# EAGLE design VCA (EAGLE 8.2.0)
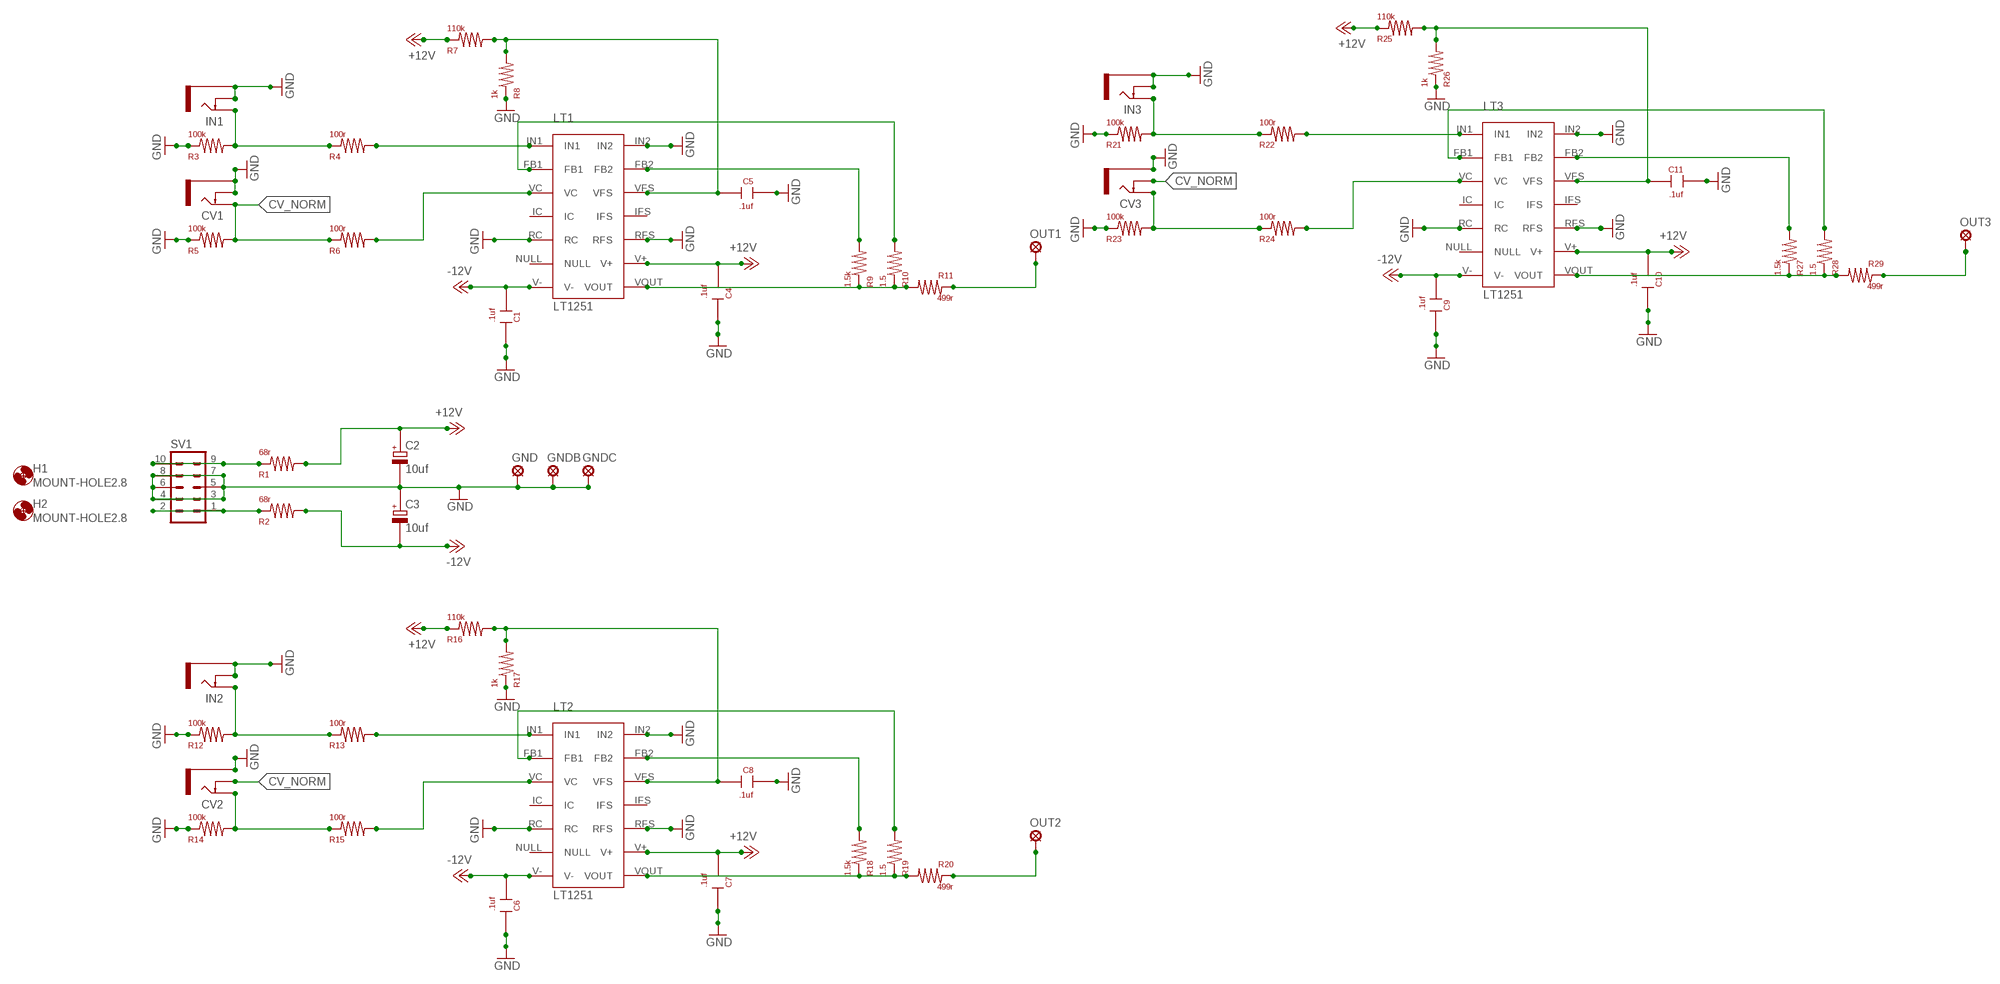
[diagram p0: schematic, sheet 1]

## Parts
C1  .1uf  CAPACITOR_FILM  [CAPACITOR_FILM]
C2  10uf  CAPACITOR_ELECTRO  [CAPACITOR_ELECTRO]
C3  10uf  CAPACITOR_ELECTRO  [CAPACITOR_ELECTRO]
C4  .1uf  CAPACITOR_FILM  [CAPACITOR_FILM]
C5  .1uf  CAPACITOR_FILM  [CAPACITOR_FILM]
C6  .1uf  CAPACITOR_FILM  [CAPACITOR_FILM]
C7  .1uf  CAPACITOR_FILM  [CAPACITOR_FILM]
C8  .1uf  CAPACITOR_FILM  [CAPACITOR_FILM]
C9  .1uf  CAPACITOR_FILM  [CAPACITOR_FILM]
C10  .1uf  CAPACITOR_FILM  [CAPACITOR_FILM]
C11  .1uf  CAPACITOR_FILM  [CAPACITOR_FILM]
CV1  PJ302M  [PJ302M]
CV2  PJ302M  [PJ302M]
CV3  PJ302M  [PJ302M]
GND  LSP10  [LSP10]
GNDB  LSP10  [LSP10]
GNDC  LSP10  [LSP10]
H1  MOUNT-HOLE2.8  [2,8]
H2  MOUNT-HOLE2.8  [2,8]
IN1  PJ302M  [PJ302M]
IN2  PJ302M  [PJ302M]
IN3  PJ302M  [PJ302M]
LT1  LT1251  [TL1251]
LT2  LT1251  [TL1251]
LT3  LT1251  [TL1251]
OUT1  LSP10  [LSP10]
OUT2  LSP10  [LSP10]
OUT3  LSP10  [LSP10]
R1  68r  RESISTOR  [RESISTOR]
R2  68r  RESISTOR  [RESISTOR]
R3  100k  RESISTOR  [RESISTOR]
R4  100r  RESISTOR  [RESISTOR]
R5  100k  RESISTOR  [RESISTOR]
R6  100r  RESISTOR  [RESISTOR]
R7  110k  RESISTOR  [RESISTOR]
R8  1k  RESISTOR  [RESISTOR]
R9  1.5k  RESISTOR  [RESISTOR]
R10  1.5  RESISTOR  [RESISTOR]
R11  499r  RESISTOR  [RESISTOR]
R12  100k  RESISTOR  [RESISTOR]
R13  100r  RESISTOR  [RESISTOR]
R14  100k  RESISTOR  [RESISTOR]
R15  100r  RESISTOR  [RESISTOR]
R16  110k  RESISTOR  [RESISTOR]
R17  1k  RESISTOR  [RESISTOR]
R18  1.5k  RESISTOR  [RESISTOR]
R19  1.5  RESISTOR  [RESISTOR]
R20  499r  RESISTOR  [RESISTOR]
R21  100k  RESISTOR  [RESISTOR]
R22  100r  RESISTOR  [RESISTOR]
R23  100k  RESISTOR  [RESISTOR]
R24  100r  RESISTOR  [RESISTOR]
R25  110k  RESISTOR  [RESISTOR]
R26  1k  RESISTOR  [RESISTOR]
R27  1.5k  RESISTOR  [RESISTOR]
R28  1.5  RESISTOR  [RESISTOR]
R29  499r  RESISTOR  [RESISTOR]
SV1  EURORACK10  [EURORACK10]

## Nets
+12V: C2.+ C4.P$2 C7.P$2 C10.P$2 LT1.V+ LT2.V+ LT3.V+ R1.P$2 R7.P$1 R16.P$1 R25.P$1
-12V: C1.P$2 C3.- C6.P$2 C9.P$2 LT1.V- LT2.V- LT3.V- R2.P$2
CV_NORM: CV1.TIP CV2.SW(SWITCH) CV3.SW(SWITCH) R5.P$2 R6.P$1
GND: C1.P$1 C2.- C3.+ C4.P$1 C5.P$1 C6.P$1 C7.P$1 C8.P$1 C9.P$1 C10.P$1 C11.P$1 CV1.GND(SLEEVE) CV1.SW(SWITCH) CV2.GND(SLEEVE) CV3.GND(SLEEVE) GND.MP GNDB.MP GNDC.MP IN1.GND(SLEEVE) IN1.SW(SWITCH) IN2.GND(SLEEVE) IN2.SW(SWITCH) IN3.GND(SLEEVE) IN3.SW(SWITCH) LT1.IN2 LT1.RC LT1.RFS LT2.IN2 LT2.RC LT2.RFS LT3.IN2 LT3.RC LT3.RFS R3.P$1 R5.P$1 R8.P$1 R12.P$1 R14.P$1 R17.P$1 R21.P$1 R23.P$1 R26.P$1 SV1.3 SV1.4 SV1.5 SV1.6 SV1.7 SV1.8
N$1: LT1.IN1 R4.P$2
N$2: R1.P$1 SV1.9 SV1.10
N$3: IN2.TIP R12.P$2 R13.P$1
N$4: LT1.VC R6.P$2
N$5: CV2.TIP R14.P$2 R15.P$1
N$6: LT2.IN1 R13.P$2
N$7: C5.P$2 LT1.VFS R7.P$2 R8.P$2
N$8: R2.P$1 SV1.1 SV1.2
N$9: IN1.TIP R3.P$2 R4.P$1
N$11: LT1.VOUT R9.P$1 R10.P$1 R11.P$2
N$12: LT1.FB2 R9.P$2
N$13: LT1.FB1 R10.P$2
N$14: OUT1.MP R11.P$1
N$15: LT2.VC R15.P$2
N$16: C8.P$2 LT2.VFS R16.P$2 R17.P$2
N$17: LT2.VOUT R18.P$1 R19.P$1 R20.P$2
N$18: LT2.FB2 R18.P$2
N$19: LT2.FB1 R19.P$2
N$20: OUT2.MP R20.P$1
N$21: IN3.TIP R21.P$2 R22.P$1
N$23: LT3.IN1 R22.P$2
N$24: LT3.VC R24.P$2
N$25: C11.P$2 LT3.VFS R25.P$2 R26.P$2
N$26: LT3.VOUT R27.P$1 R28.P$1 R29.P$2
N$27: LT3.FB2 R27.P$2
N$28: LT3.FB1 R28.P$2
N$29: OUT3.MP R29.P$1
N$30: CV3.TIP R23.P$2 R24.P$1
Unconnected: LT1.IC LT1.IFS LT1.NULL LT2.IC LT2.IFS LT2.NULL LT3.IC LT3.IFS LT3.NULL

## Library data of the parts
C1 C4-C11 = MAR:CAPACITOR_FILM
C2 C3 = MAR:CAPACITOR_ELECTRO
CV1-CV3 IN1-IN3 = pj302m:PJ302M: PJ302M horizontal / right angled mount 3.5 mm jack socket
GND GNDB GNDC OUT1-OUT3 = solpad:LSP10: SOLDER PAD drill 1.0 mm, distributor Buerklin, 12H555
H1 H2 = holes:MOUNT-HOLE: MOUNTING HOLE with drill center marker
LT1-LT3 = VIDEO:LT1251
R1-R29 = MAR:RESISTOR
SV1 = MAR:EURORACK10: 10 POLE EURORACK CONNECTOR

## Board
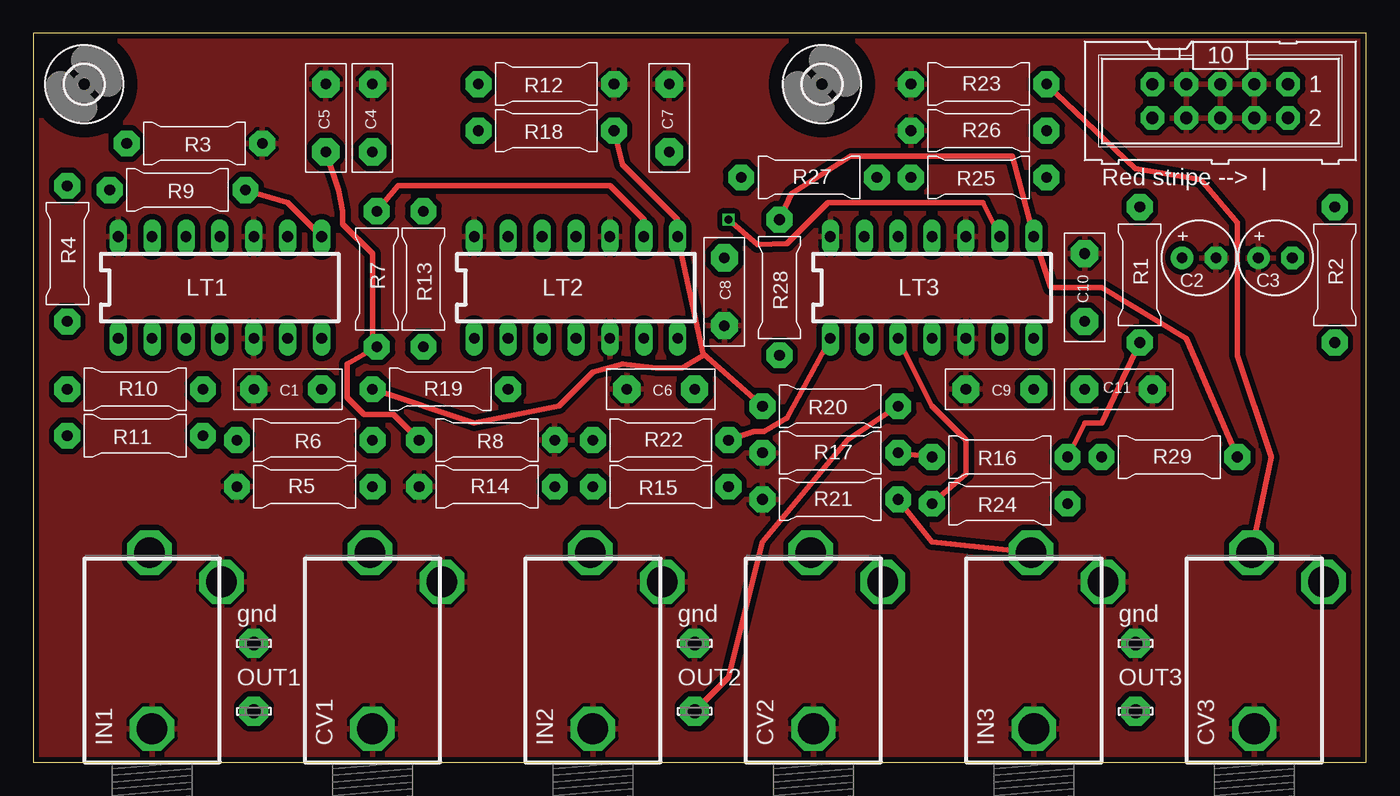
[diagram p1: board, top side]
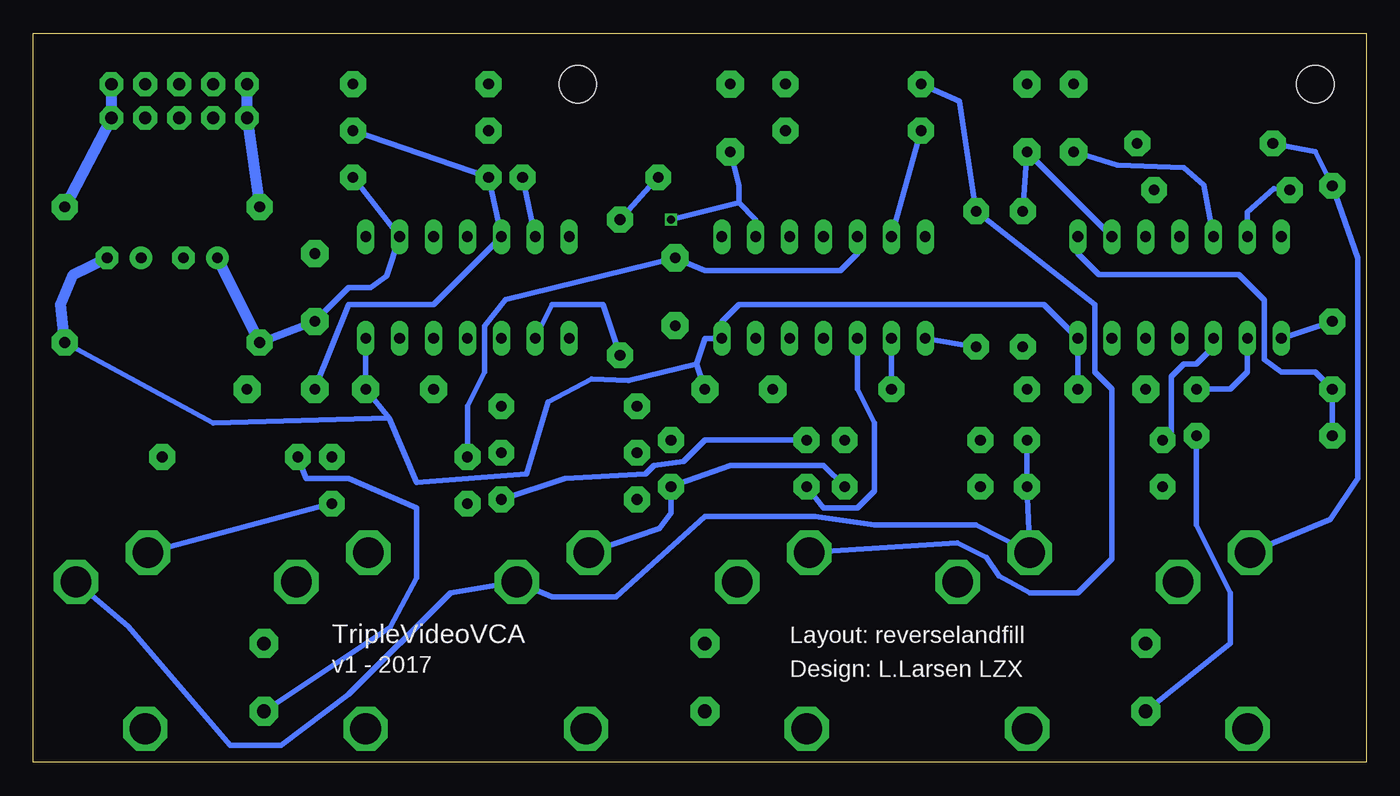
[diagram p2: board, bottom side, seen from below]

Size 99.82 x 54.6 mm. Coordinates in mm from the lower left corner, seen from the top.
Outline: 0,0 99.82,0 99.82,54.6 0,54.6 0,0
Copper layers (1*16): Top 0.035mm / dielectric 1.5mm / Bottom 0.035mm
Design rules "dirt_cheap_dirty_boards.v1": minimum track width 5mil, minimum drill 12mil, track to track 5mil, track to pad 5mil, pad to pad 5mil, via to via 5mil, smd to smd 0mil, copper to edge 10mil, drill to drill 10mil, minimum pad ring 10mil, minimum via ring 6mil, stop-mask expansion 2mil, vias tented up to drill 25mil, thermal gap 10mil

### Footprints (pad centres in the part's own frame; a part is rotated, then mirrored left to right if it is on the bottom)
CAPACITOR_FILM = drill 0.8 pad 2.032 octagon: P$1 -2.54,0; P$2 2.54,0
CAPACITOR_ELECTRO = drill 0.813 pad 1.676: + -1.27,0 | drill 0.813 pad 1.676 octagon: - 1.27,0
PJ302M = drill 2.3 pad 3.3 octagon: GND 2.5,0; SW 13.5,-5.2; TIP 15.7,0.2
LSP10 = drill 1.016 pad 2.159 octagon: MP 0,0
2,8 = hole 2.8: 0,0
TL1251 = drill 0.8 long: FB1 -3.81,5.08; FB2 3.81,5.08; IC -3.81,0; IFS 3.81,0; IN1 -3.81,7.62; IN2 3.81,7.62; NULL -3.81,-5.08; RC -3.81,-2.54; RFS 3.81,-2.54; V+ 3.81,-5.08; V- -3.81,-7.62; VC -3.81,2.54; VFS 3.81,2.54; VOUT 3.81,-7.62
RESISTOR = drill 0.8 pad 1.93 octagon: P$1 -5.08,0; P$2 5.08,0
EURORACK10 = drill 0.914 pad 1.778 octagon: 1 -5.08,-1.27; 2 -5.08,1.27; 3 -2.54,-1.27; 4 -2.54,1.27; 5 0,-1.27; 6 0,1.27; 7 2.54,-1.27; 8 2.54,1.27; 9 5.08,-1.27; 10 5.08,1.27

### Placement (x,y rotation side)
C1  19.05,27.94 0 top
C2  87.31,37.78 0 top
C3  93.03,37.78 0 top
C4  25.4,48.26 270 top
C5  21.91,48.26 270 top
C6  46.99,27.94 0 top
C7  47.62,48.26 270 top
C8  51.75,35.24 90 top
C9  72.39,27.94 0 top
C10  78.74,35.56 270 top
C11  81.28,27.94 180 top
CV1  25.4,0 90 top
CV2  58.42,0 90 top
CV3  91.44,0 90 top
GND  82.55,8.89 0 top
GNDB  16.51,8.89 0 top
GNDC  49.53,8.89 0 top
H1  3.81,50.8 0 top
H2  59.05,50.8 0 top
IN1  8.89,0 90 top
IN2  41.91,0 90 top
IN3  74.93,0 90 top
LT1  13.97,35.56 90 top
LT2  40.64,35.56 90 top
LT3  67.31,35.56 90 top
OUT1  16.51,3.81 0 top
OUT2  49.53,3.81 0 top
OUT3  82.55,3.81 0 top
R1  82.87,36.51 270 top
R2  97.47,36.51 270 top
R3  12.06,46.35 180 top
R4  2.54,38.1 270 top
R5  20.32,20.64 0 top
R6  20.32,24.13 180 top
R7  25.72,36.2 270 top
R8  33.97,24.13 180 top
R9  10.79,42.86 180 top
R10  7.62,27.94 0 top
R11  7.62,24.45 180 top
R12  38.42,50.8 180 top
R13  29.21,36.2 270 top
R14  33.97,20.64 0 top
R15  46.99,20.64 180 top
R16  72.39,22.86 180 top
R17  59.69,23.18 0 top
R18  38.42,47.31 180 top
R19  30.48,27.94 0 top
R20  59.69,26.67 180 top
R21  59.69,19.68 0 top
R22  46.99,24.13 0 top
R23  70.8,50.8 0 top
R24  72.39,19.37 180 top
R25  70.8,43.81 180 top
R26  70.8,47.31 0 top
R27  58.1,43.81 0 top
R28  55.88,35.56 270 top
R29  85.09,22.86 0 top
SV1  88.9,49.53 180 top

### Tracks (layer width: path | path; a pad name or v marks a point on that pad's centre or on a via)
+12V  (via drill 0.6)
  Top 0.406: R7.P$1 27.3,43.18 43.18,43.18 45.72,40.64 LT2.V+ | R1.P$2 80.01,25.4 78.74,25.4 R16.P$1 | v52.07,40.64 54.25,38.79 56.44,38.87 59.53,41.91 71.12,41.91 LT3.V+
  Bottom 0.406: R7.P$1 C4.P$2 LT1.V+ | C7.P$2 46.99,43.18 46.99,41.91 | 46.99,41.91 45.72,40.64 LT2.V+ | R25.P$1 LT3.V+ 73.37,36.43 74.58,35.56 76.2,35.56 C10.P$2 | 46.99,41.91 v52.07,40.64
  Bottom 0.61: C10.P$2 R1.P$2
  Bottom 0.813: C2.+ R1.P$2
-12V
  Bottom 0.406: C1.P$2 LT1.V- 24.13,34.29 46.99,34.29 48.26,33.02 LT2.V- 49.53,31.75 50.16,29.84 | 50.16,29.84 55.24,28.57 58.01,28.7 61.28,26.99 62.87,21.59 71.12,20.95 73.19,25.77 | C6.P$2 50.16,29.84 | 73.19,25.77 C9.P$2 LT3.V- | R2.P$2 86.36,25.4 73.19,25.77
  Bottom 0.813: R2.P$2 97.79,34.29 96.84,36.51 C3.-
CV_NORM
  Bottom 0.406: R6.P$1 R5.P$2 CV1.TIP 29.21,17.78 36.83,17.78 41.27,18.41 49.53,18.41 56.2,12.38 60.96,12.38 CV2.SW 68.58,12.7 76.2,5.08 81.28,1.27 85.09,1.27 92.71,10.16 CV3.SW
GND
  pour Top (isolate 0.406): 0,54.61 0,0 100.33,0 100.33,54.61
N$1
  Bottom 0.406: R4.P$2 LT1.IN1
N$2
  Bottom 0.813: SV1.9 SV1.10 R1.P$1
N$3
  Bottom 0.406: IN2.TIP 30.62,16.42 28.43,15.33 27.5,13.95 25.17,12.7 21.59,12.7 19.05,15.24 19.05,27.94 20.32,29.21 20.32,34.29 R13.P$1 30.48,49.53 R12.P$2
N$4
  Bottom 0.406: R6.P$2 14.61,24.77 14.61,28.89 13.65,29.84 12.7,29.84 11.43,31.11 LT1.VC
N$5
  Bottom 0.406: CV2.TIP 52.91,17.5 52.07,18.66 R15.P$1 47.62,22.23 40.64,22.23 R14.P$2
N$6
  Bottom 0.406: R13.P$2 LT2.IN1
N$7
  Top 0.406: R8.P$2 26.99,26.04 24.77,26.04 23.5,27.3 23.5,29.84 R7.P$2 25.4,31.75 25.4,38.1 23.18,40.32 23.18,41.27 22.86,42.86 C5.P$2
  Bottom 0.406: C5.P$2 18.65,44.74 13.65,44.54 12.15,43.24 LT1.VFS
N$8
  Bottom 0.813: SV1.1 SV1.2 R2.P$1
N$9
  Bottom 0.406: R3.P$2 3.81,45.72 R4.P$1 0.64,37.78 0.64,21.27 2.69,18.2 IN1.TIP
N$11
  Top 0.406: LT1.VOUT 19.05,41.91 R9.P$1
  Bottom 0.406: R11.P$2 R10.P$1 3.81,29.21 6.35,29.21 7.62,30.16 7.62,34.61 9.53,36.51 20,36.51 21.59,38.1 LT1.VOUT
N$12
  Bottom 0.406: LT1.FB2 8.89,41.2 6.92,42.98 R9.P$2
N$13
  Bottom 0.406: R10.P$2 10.16,27.94 8.89,29.21 LT1.FB1
N$14
  Bottom 0.406: R11.P$1 12.7,17.78 10.16,12.7 10.16,8.89 OUT1.MP
N$15
  Bottom 0.406: R15.P$2 40.64,19.05 38.1,19.05 36.83,20.32 36.83,25.4 38.1,27.94 LT2.VC
N$16
  Top 0.406: R17.P$2 R16.P$2
  Bottom 0.406: LT2.VFS 38.1,38.1 39.37,36.83 49.53,36.83 C8.P$2 64.47,34.67 66.04,32.67 66.04,29.21 67.31,26.67 R16.P$2
N$17
  Top 0.406: R18.P$1 44.13,44.77 48.26,40.64 LT2.VOUT 50.14,30.61 | 50.14,30.61 50.16,30.48 48.58,29.53 46.67,29.53 44.13,29.84 41.91,29.21 39.37,26.67 33.02,25.4 R19.P$1 | 50.14,30.61 R20.P$2
N$18
  Bottom 0.406: R18.P$2 LT2.FB2
N$19
  Bottom 0.406: R19.P$2 LT2.FB1
N$20
  Top 0.406: R20.P$1 60.96,24.13 54.61,16.51 52.07,6.35 OUT2.MP
N$21
  Top 0.406: R21.P$2 67.31,16.51 IN3.TIP
  Bottom 0.406: R22.P$1 49.53,24.13 51.12,22.54 53.34,22.23 53.98,21.59 60.01,21.27 R21.P$2
N$23
  Top 0.406: R22.P$2 53.98,24.77 54.74,24.77 56.43,25.77 LT3.IN1
N$24
  Top 0.406: R24.P$2 69.85,21.59 69.85,24.13 67.31,26.67 LT3.VC
N$25
  Bottom 0.406: R26.P$2 R25.P$2 LT3.VFS 69.85,34.29 76.2,34.29 C11.P$2
N$26
  Top 0.406: R29.P$2 86.36,31.75 80.01,35.56 76.2,35.56 LT3.VOUT 73.34,45.4 61.19,45.4 56.8,42.61 R28.P$1
  Bottom 0.406: R27.P$1 R28.P$1
N$27
  Bottom 0.406: R27.P$2 LT3.FB2
N$28
  Bottom 0.406: LT3.FB1 60.96,34.29 57.15,34.29 R28.P$2
N$29
  Bottom 0.406: OUT3.MP 73.09,10.11 71.12,13.8 71.12,19.05 76.2,21.27 79.38,21.27 R29.P$1
N$30
  Top 0.406: R23.P$2 82.55,44.45 87.44,43.63 90.17,40.41 90.17,30.48 92.71,22.86 CV3.TIP
  Bottom 0.406: CV3.TIP R24.P$1

### Text on the board
tNames: Red stripe --> | | gnd | gnd | gnd
bNames: Layout: reverselandfill | TripleVideoVCA | v1 - 2017 | Design: L.Larsen LZX